# Altium schematic sheet power.SchDoc
size A4
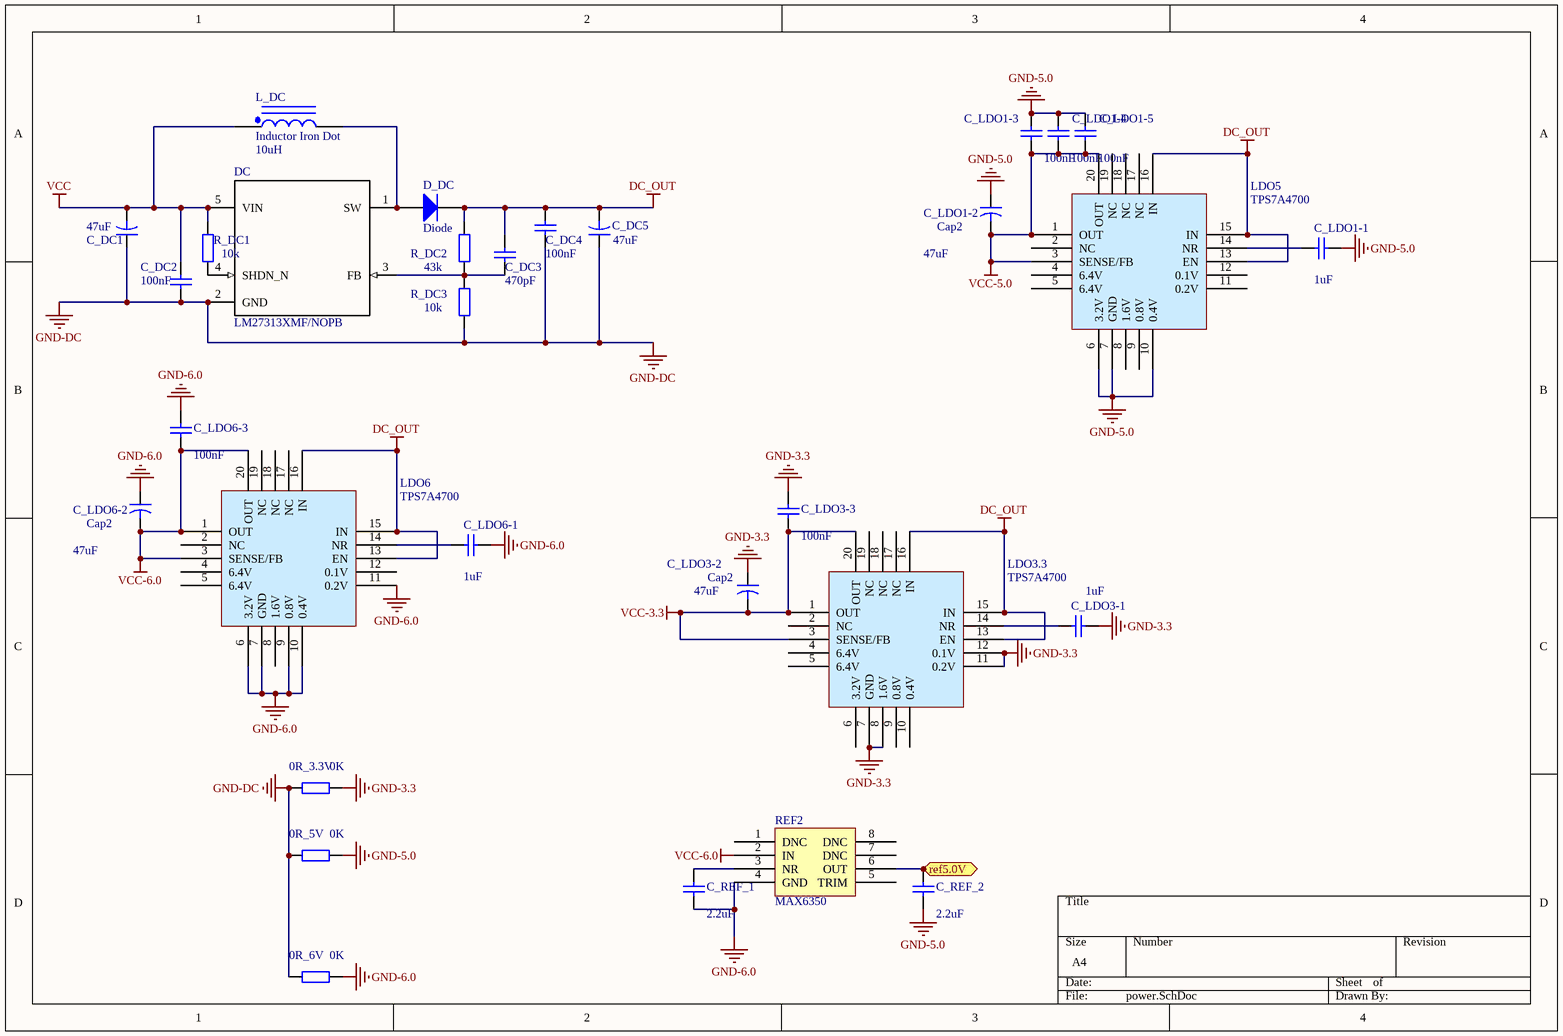
[diagram p0: power.SchDoc]

## Parts
0R_3.3V  value 0K  [0603 - no]
0R_5V  value 0K  [0603 - no]
0R_6V  value 0K  [0603 - no]
C_DC1  value 47uF  [1210]
C_DC2  value 100nF  [0603 - no]
C_DC3  value 470pF  [0603 - no]
C_DC4  value 100nF  [0805]
C_DC5  value 47uF  [1210]
C_LDO1-1  value 1uF  [0603 - no]
C_LDO1-2  Cap2  value 47uF  [1210]
C_LDO1-3  value 100nF  [0805]
C_LDO1-4  value 100nF  [0805]
C_LDO1-5  value 100nF  [0805]
C_LDO3-1  value 1uF  [0603 - no]
C_LDO3-2  Cap2  value 47uF  [1210]
C_LDO3-3  value 100nF  [0805]
C_LDO6-1  value 1uF  [0603 - no]
C_LDO6-2  Cap2  value 47uF  [1210]
C_LDO6-3  value 100nF  [0805]
C_REF_1  value 2.2uF  [0603 - no]
C_REF_2  value 2.2uF  [0603 - no]
D_DC  Diode  [Diode-SOD123]
DC  LM27313XMF/NOPB  [DBV0005A]
L_DC  Inductor Iron Dot  value 10uH  [GDNR5040]
LDO3.3  TPS7A4700  [TPS7A4700 - b]
LDO5  TPS7A4700  [TPS7A4700 - b]
LDO6  TPS7A4700  [TPS7A4700 - b]
R_DC1  value 10k  [0603 - no]
R_DC2  value 43k  [0603 - no]
R_DC3  value 10k  [0603 - no]
REF2  MAX6350  [D8]

## Ports
ref5.0V

## Nets
DC_OUT: C_DC3.2 C_DC4.2 C_DC5.2 D_DC.2(K) LDO3.3.13(EN) LDO3.3.15(IN) LDO3.3.16(IN) LDO5.13(EN) LDO5.15(IN) LDO5.16(IN) LDO6.13(EN) LDO6.15(IN) LDO6.16(IN) R_DC2.2
GND-3.3: 0R_3.3V.1 C_LDO3-1.1 C_LDO3-2.1 C_LDO3-3.1 LDO3.3.7(GND) LDO3.3.8(1.6V) LDO3.3.11(0.2V) LDO3.3.12(0.1V)
GND-5.0: 0R_5V.1 C_LDO1-1.1 C_LDO1-2.1 C_LDO1-3.1 C_LDO1-4.1 C_LDO1-5.1 C_REF_2.2 LDO5.6(3.2V) LDO5.7(GND) LDO5.10(0.4V)
GND-6.0: 0R_6V.1 C_LDO6-1.1 C_LDO6-2.1 C_LDO6-3.1 C_REF_1.2 LDO6.6(3.2V) LDO6.7(GND) LDO6.9(0.8V) LDO6.10(0.4V) LDO6.11(0.2V) REF2.4(GND)
GND-DC: 0R_3.3V.2 0R_5V.2 0R_6V.2 C_DC1.1 C_DC2.1 C_DC4.1 C_DC5.1 DC.2(GND) R_DC3.1
VCC: C_DC1.2 C_DC2.2 DC.5(VIN) L_DC.1 R_DC1.2
VCC-3.3: C_LDO3-2.2 C_LDO3-3.2 LDO3.3.1(OUT) LDO3.3.3(SENSE/FB) LDO3.3.20(OUT)
VCC-5.0: C_LDO1-2.2 C_LDO1-3.2 C_LDO1-4.2 C_LDO1-5.2 LDO5.1(OUT) LDO5.3(SENSE/FB) LDO5.20(OUT)
VCC-6.0: C_LDO6-2.2 C_LDO6-3.2 LDO6.1(OUT) LDO6.3(SENSE/FB) LDO6.20(OUT) REF2.2(IN)
ref5.0V: C_REF_2.1 REF2.6(OUT) ; port ref5.0V
NetC_DC3_1: C_DC3.1 DC.3(FB) R_DC2.1 R_DC3.2
NetC_LDO1-1_2: C_LDO1-1.2 LDO5.14(NR)
NetC_LDO3-1_2: C_LDO3-1.2 LDO3.3.14(NR)
NetC_LDO6-1_2: C_LDO6-1.2 LDO6.14(NR)
NetC_REF_1_1: C_REF_1.1 REF2.3(NR)
NetD_DC_1: D_DC.1(A) DC.1(SW) L_DC.2
NetDC_4: DC.4(SHDN_N) R_DC1.1

Not connected (* = marked no-connect by the designer): LDO3.3 2(NC) 4(6.4V) 5(6.4V) 6(3.2V) 9(0.8V) 10(0.4V) 17(NC) 18(NC) 19(NC); LDO5 2(NC) 4(6.4V) 5(6.4V) 8(1.6V) 9(0.8V) 11(0.2V) 12(0.1V) 17(NC) 18(NC) 19(NC); LDO6 2(NC) 4(6.4V) 5(6.4V) 8(1.6V) 12(0.1V) 17(NC) 18(NC) 19(NC); REF2 1(DNC) 5(TRIM) 7(DNC) 8(DNC)

## Library data of the parts
0R_3.3V 0R_5V 0R_6V R_DC1-R_DC3 = Res2: Resistor; Published: 8-Jun-2000; LatestRevisionDate: 17-Jul-2002; LatestRevisionNote: Re-released for DXP Platform.; PackageReference: AXIAL-0.4; Publisher: Altium Limited; PackageDescription: Axial Device, Thru-Hole; 2 Leads; 0.4 in Pin Spacing
C_DC1 C_DC5 C_LDO1-2 C_LDO3-2 C_LDO6-2 = Cap2: Capacitor; Published: 23-Sep-2002; PackageReference: CAPR5-4X5; Publisher: Altium Limited; PackageDescription: Capacitor; 2 Leads
C_DC2-C_DC4 C_LDO1-1 C_LDO1-3-C_LDO1-5 C_LDO3-1 C_LDO3-3 C_LDO6-1 C_LDO6-3 C_REF_1 C_REF_2 = Cap: Capacitor; Published: 8-Jun-2000; LatestRevisionDate: 17-Jul-2002; LatestRevisionNote: Re-released for DXP Platform.; PackageReference: RAD-0.3; Publisher: Altium Limited; PackageDescription: Radial Cap, Thru-Hole; 2 Leads; 0.3 in Pin Spacing
D_DC = Diode: Default Diode; Published: 8-Jun-2000; LatestRevisionDate: 17-Jul-2002; LatestRevisionNote: Re-released for DXP Platform.; PackageVersion: Sep-1996; PackageReference: SMC; Publisher: Altium Limited; PackageDescription: DO-214-AB/SMC; 2 C-Bend Leads; Body 7.9 x 5.9 mm, inc. leads (LxW); Code_JEDEC: DO-214-AB
DC = LM27313XMF/NOPB: Imported; Manufacturer: Texas Instruments; CompType: IC; PIN_COUNT: 5; PartNumber: LM27313XMF/NOPB; PackageReference: DBV0005A; MountType: SMT; RoHS: Y; RefDes: RefDes; Type: DEV; Value: Value
L_DC = Inductor Iron Dot: Magnetic-Core Inductor with Winding Polarity Marking; Published: 24-Mar-1999; LatestRevisionDate: 17-Jul-2002; LatestRevisionNote: Re-released for DXP Platform.; PackageReference: DIODE_SMC; Publisher: Altium Limited; PackageDescription: Diode; 2 Leads